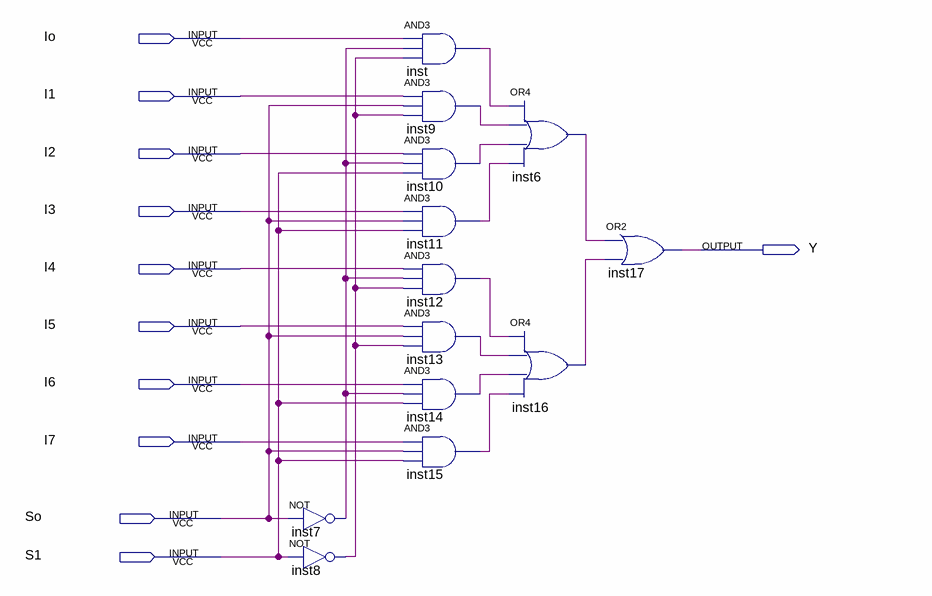
[diagram p0: schematic sheet]
// Quartus schematic Multiplexor_USE(8-1).bdf as structural Verilog: 13 symbols, 11 pins
module \Multiplexor_USE(8-1)  (
  input  Io,
  input  I1,
  input  I2,
  input  I3,
  input  I4,
  input  I5,
  input  I6,
  input  I7,
  input  So,
  input  S1,
  output Y
);

  wire inst6_out, inst7_out, inst8_out, inst9_out, inst10_out, inst11_out, inst12_out, inst13_out,
       inst14_out, inst15_out, inst16_out, inst_out;

  not inst7 (inst7_out, So);
  not inst8 (inst8_out, S1);
  and inst (inst_out, Io, inst7_out, inst8_out);
  and inst9 (inst9_out, I1, So, inst8_out);
  and inst10 (inst10_out, I2, inst7_out, S1);
  and inst11 (inst11_out, I3, So, S1);
  and inst12 (inst12_out, I4, inst7_out, inst8_out);
  and inst13 (inst13_out, I5, So, inst8_out);
  and inst14 (inst14_out, I6, inst7_out, S1);
  and inst15 (inst15_out, I7, So, S1);
  or inst6 (inst6_out, inst_out, inst9_out, inst10_out, inst11_out);
  or inst16 (inst16_out, inst12_out, inst13_out, inst14_out, inst15_out);
  or inst17 (Y, inst6_out, inst16_out);
endmodule
